# EAGLE design controller (EAGLE 7.1.0)
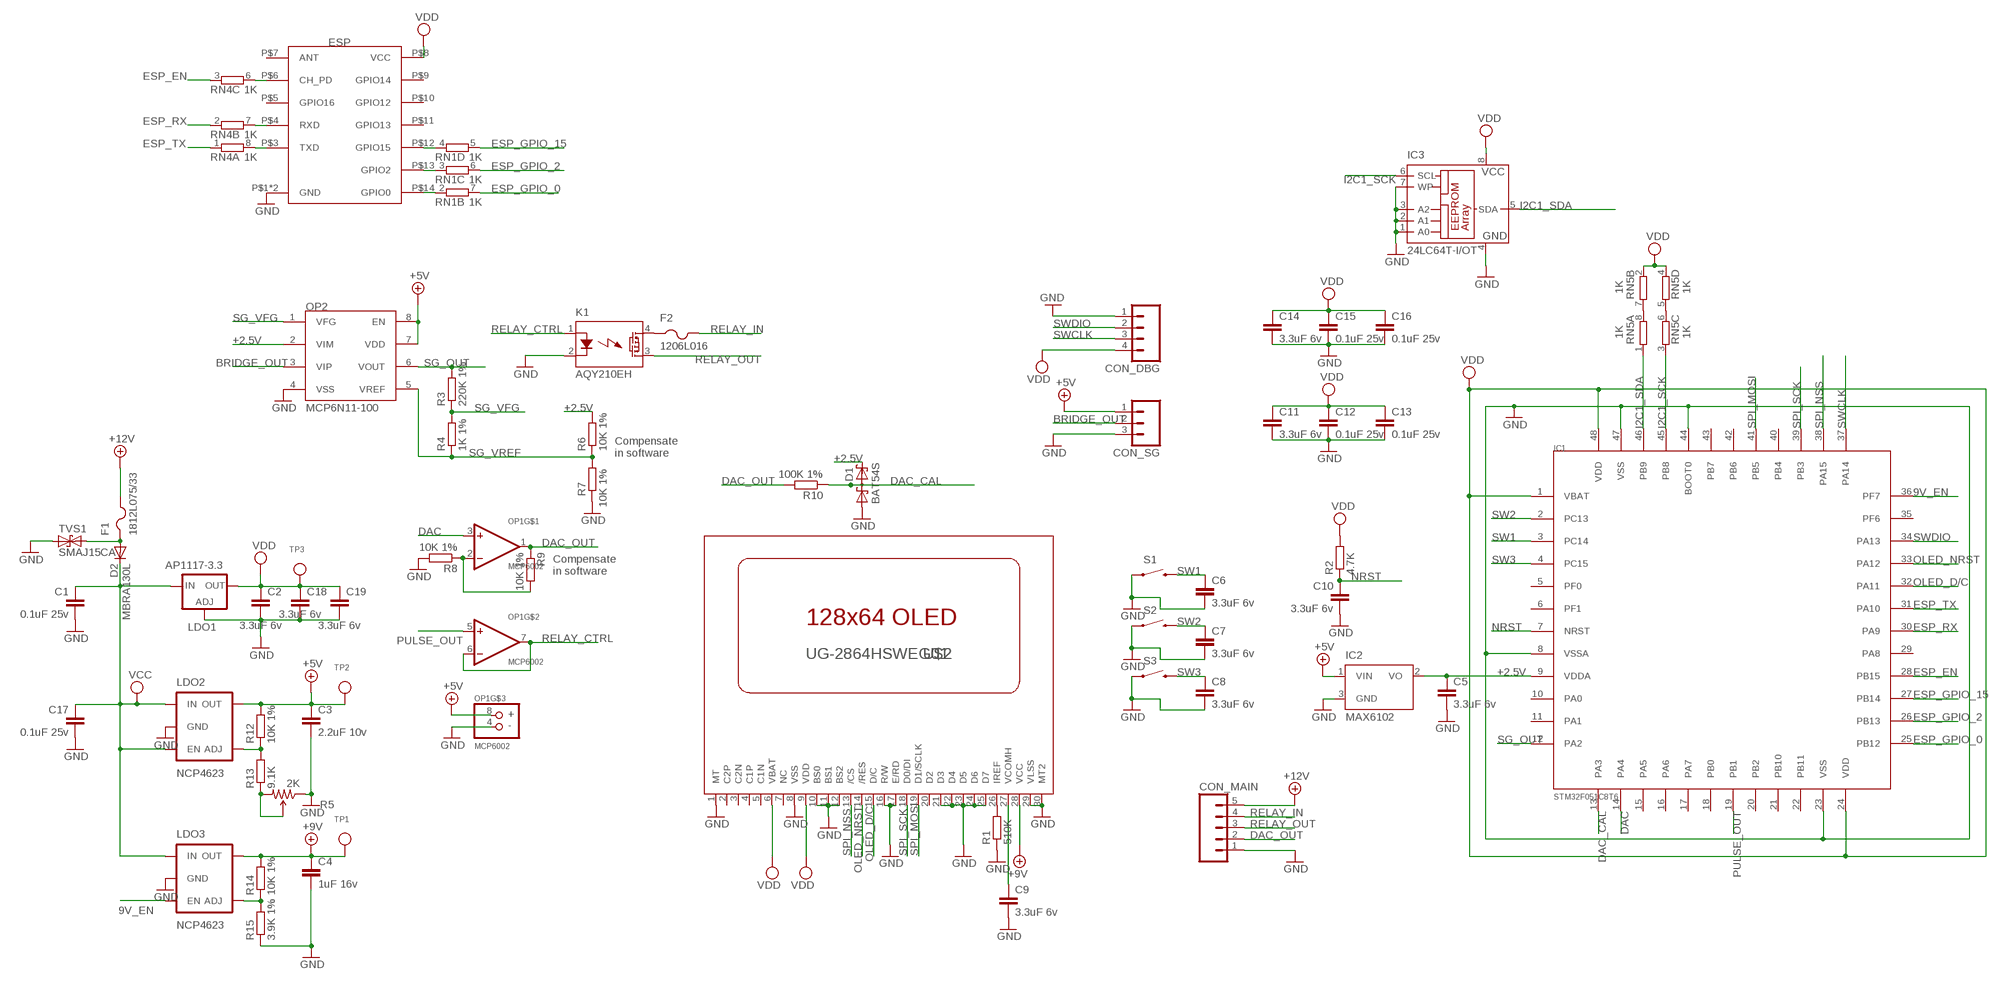
[diagram p0: schematic, sheet 1]

## Parts
C1  0.1uF 25v  C-EUC0603  [C0603]
C2  3.3uF 6v  C-EUC0603  [C0603]
C3  2.2uF 10v  C-EUC0603  [C0603]
C4  1uF 16v  C-EUC0603  [C0603]
C5  3.3uF 6v  C-EUC0603  [C0603]
C6  3.3uF 6v  C-EUC0603  [C0603]
C7  3.3uF 6v  C-EUC0603  [C0603]
C8  3.3uF 6v  C-EUC0603  [C0603]
C9  3.3uF 6v  C-EUC0603  [C0603]
C10  3.3uF 6v  C-EUC0603  [C0603]
C11  3.3uF 6v  C-EUC0603  [C0603]
C12  0.1uF 25v  C-EUC0603  [C0603]
C13  0.1uF 25v  C-EUC0603  [C0603]
C14  3.3uF 6v  C-EUC0603  [C0603]
C15  0.1uF 25v  C-EUC0603  [C0603]
C16  0.1uF 25v  C-EUC0603  [C0603]
C17  0.1uF 25v  C-EUC0603  [C0603]
C18  3.3uF 6v  C-EUC0603  [C0603]
C19  3.3uF 6v  C-EUC0603  [C0603]
CON_DBG  M04LOCK  [1X04_LOCK]
CON_MAIN  M05LOCK  [1X05_LOCK]
CON_SG  M03LOCK  [1X03_LOCK]
D1  BAT54S  [SOT23]
D2  MBRA130L  DIODESMA  [SMA-DIODE]
ESP  ESP8266  [ESP-03]
F1  1812L075/33  PTCFUSE-1812  [1812]
F2  1206L016  PTCFUSE-1206  [R1206]
IC1  STM32F051C8T6  STM32F05XC  [LQFP-48]
IC2  MAX6102  MC1525TT  [SOT23]
IC3  24LC64T-I/OT  24C01ASN  [SO-08]
K1  AQY210EH  AQY21SOP  [SOP04]
LDO1  AP1117-3.3  LD117ADT33TR  [DPACK]
LDO2  NCP4623  [SOT23-5]
LDO3  NCP4623  [SOT23-5]
OP1  MCP6002  MCP6022-MSOP  [MSOP-8]
OP2  MCP6N11-100  MCP6N11  [SO08]
R1  510K  R-EU_R0603  [R0603]
R2  4.7K  R-EU_R0603  [R0603]
R3  220K 1%  R-EU_R0603  [R0603]
R4  1K 1%  R-EU_R0603  [R0603]
R5  2K  TRIMPOT3MM-2  [TRIMPOT-3MM-2]
R6  10K 1%  R-EU_R0603  [R0603]
R7  10K 1%  R-EU_R0603  [R0603]
R8  10K 1%  R-EU_R0603  [R0603]
R9  10K 1%  R-EU_R0603  [R0603]
R10  100K 1%  R-EU_R0603  [R0603]
R12  10K 1%  R-EU_R0603  [R0603]
R13  9.1K  R-EU_R0603  [R0603]
R14  10K 1%  R-EU_R0603  [R0603]
R15  3.9K 1%  R-EU_R0603  [R0603]
RN1  1K  4R-NCAY16  [CAY16]
RN4  1K  4R-NCAY16  [CAY16]
RN5  1K  4R-NCAY16  [CAY16]
S1  SWITCH-MOMENTARY-2SMD-2  [TACTILE_SWITCH_SMD-2]
S2  SWITCH-MOMENTARY-2SMD-2  [TACTILE_SWITCH_SMD-2]
S3  SWITCH-MOMENTARY-2SMD-2  [TACTILE_SWITCH_SMD-2]
TP1  TESTPOINTROUND2MM  [TESTPOINT_ROUND_2MM]
TP2  TESTPOINTROUND2MM  [TESTPOINT_ROUND_2MM]
TP3  TESTPOINTROUND2MM  [TESTPOINT_ROUND_2MM]
TVS1  SMAJ15CA  TVS  [SMA-DIODE]
U$2  UG-2864HSWEG01  [1X30-0.7MM]

## Nets
9V_EN: IC1.36(PF7) LDO3.5(EN)
+2.5V: C5.1 D1.2(C2) IC1.9(VDDA) IC2.2(VO) OP2.2(VIM) R6.2
+5V: C3.1 CON_SG.1 IC2.1(VIN) LDO2.1(OUT) OP1.8(+) OP2.7(VDD) OP2.8(EN) R12.2 TP2.P$1
+9V: C4.1 LDO3.1(OUT) R14.2 TP1.P$1 U$2.28(VCC)
+12V: CON_MAIN.5 F1.2
BRIDGE_OUT: CON_SG.2 OP2.3(VIP)
DAC: IC1.14(PA4) OP1.3(+IN)
DAC_CAL: D1.3(C1A2) IC1.13(PA3) R10.1
DAC_OUT: CON_MAIN.2 OP1.1(OUT) R9.1 R10.2
ESP_EN: IC1.28(PB15) RN4.3
ESP_GPIO_0: IC1.25(PB12) RN1.7
ESP_GPIO_2: IC1.26(PB13) RN1.6
ESP_GPIO_15: IC1.27(PB14) RN1.5
ESP_RX: IC1.30(PA9) RN4.2
ESP_TX: IC1.31(PA10) RN4.1
GND: C1.2 C2.2 C3.2 C4.2 C5.2 C6.2 C7.2 C8.2 C9.2 C10.2 C11.2 C12.2 C13.2 C14.2 C15.2 C16.2 C17.2 C18.2 C19.2 CON_DBG.1 CON_MAIN.1 CON_SG.3 D1.1(A1) ESP.P$1(GND) ESP.P$2(GND) IC1.8(VSSA) IC1.23(VSS) IC1.44(BOOT0) IC1.47(VSS) IC2.3(GND) IC3.1(A0) IC3.2(A1) IC3.3(A2) IC3.4(GND) IC3.7(WP) K1.2(K) LDO1.1(ADJ) LDO2.2(GND) LDO3.2(GND) OP1.4(-) OP2.4(VSS) R1.1 R5.1(CCW) R7.1 R8.2 R15.1 S1.2 S2.2 S3.2 TVS1.A U$2.1(MT) U$2.8(VSS) U$2.10(BS0) U$2.11(BS1) U$2.12(BS2) U$2.16(R/W) U$2.17(E/RD) U$2.21(D3) U$2.22(D4) U$2.23(D5) U$2.24(D6) U$2.25(D7) U$2.29(VLSS) U$2.30(MT2)
I2C1_SCK: IC1.45(PB8) IC3.6(SCL) RN5.3
I2C1_SDA: IC1.46(PB9) IC3.5(SDA) RN5.1
N$1: OP1.2(-IN) R8.1 R9.2
N$2: C9.1 U$2.27(VCOMH)
N$3: R1.2 U$2.26(IREF)
N$4: D2.A F1.1 TVS1.C
N$5 [High Voltage]: F2.1 K1.4(DS1)
N$6: LDO2.4(ADJ) R12.1 R13.2
N$7: LDO3.4(ADJ) R14.1 R15.2
N$8: R5.2(WIPER) R5.3(CW) R13.1
N$10: ESP.P$14(GPIO0) RN1.2
N$11: ESP.P$13(GPIO2) RN1.3
N$12: ESP.P$12(GPIO15) RN1.4
N$14: ESP.P$3(TXD) RN4.8
N$15: ESP.P$6(CH_PD) RN4.6
N$16: ESP.P$4(RXD) RN4.7
N$17: RN5.7 RN5.8
N$18: RN5.5 RN5.6
NRST: C10.1 IC1.7(NRST) R2.1
OLED_D/C: IC1.32(PA11) U$2.15(D/C)
OLED_NRST: IC1.33(PA12) U$2.14(/RES)
PULSE_OUT: IC1.19(PB1) OP1.5(+IN)
RELAY_CTRL: K1.1(A) OP1.6(-IN) OP1.7(OUT)
RELAY_IN [High Voltage]: CON_MAIN.4 F2.2
RELAY_OUT [High Voltage]: CON_MAIN.3 K1.3(DS2)
SG_OUT: IC1.12(PA2) OP2.6(VOUT) R3.2
SG_VFG: OP2.1(VFG) R3.1 R4.2
SG_VREF: OP2.5(VREF) R4.1 R6.1 R7.2
SPI_MOSI: IC1.41(PB5) U$2.19(D1/SCLK)
SPI_NSS: IC1.38(PA15) U$2.13(/CS)
SPI_SCK: IC1.39(PB3) U$2.18(D0/DI)
SW1: C6.1 IC1.3(PC14) S1.1
SW2: C7.1 IC1.2(PC13) S2.1
SW3: C8.1 IC1.4(PC15) S3.1
SWCLK: CON_DBG.3 IC1.37(PA14)
SWDIO: CON_DBG.2 IC1.34(PA13)
VCC: C1.1 C17.1 D2.C LDO1.3(IN) LDO2.3(IN) LDO2.5(EN) LDO3.3(IN)
VDD: C2.1 C11.1 C12.1 C13.1 C14.1 C15.1 C16.1 C18.1 C19.1 CON_DBG.4 ESP.P$8(VCC) IC1.1(VBAT) IC1.24(VDD) IC1.48(VDD) IC3.8(VCC) LDO1.4(OUT) R2.2 RN5.2 RN5.4 TP3.P$1 U$2.6(VBAT) U$2.9(VDD)
Unconnected: ESP.P$5(GPIO16) ESP.P$7(ANT) ESP.P$9(GPIO14) ESP.P$10(GPIO12) ESP.P$11(GPIO13) IC1.5(PF0) IC1.6(PF1) IC1.10(PA0) IC1.11(PA1) IC1.15(PA5) IC1.16(PA6) IC1.17(PA7) IC1.18(PB0) IC1.20(PB2) IC1.21(PB10) IC1.22(PB11) IC1.29(PA8) IC1.35(PF6) IC1.40(PB4) IC1.42(PB6) IC1.43(PB7) RN1.1 RN1.8 RN4.4 RN4.5 U$2.2(C2P) U$2.3(C2N) U$2.4(C1P) U$2.5(C1N) U$2.7(NC) U$2.20(D2)

## Notes on the sheet
- Compensate 
  in software
- Compensate 
  in software

## Library data of the parts
C1-C19 = resistor:C-EU: CAPACITOR, European symbol
CON_DBG = SparkFun-Connectors:M04: Header 4 Standard 4-pin 0.1" header. Use with straight break away headers (SKU : PRT-00116), right angle break away headers (PRT-00553), swiss pins (PRT-00743), machine pins (PRT-00117), and female headers (PRT-00115). Molex polarized connector foot print use with SKU : PRT-08231 with associated crimp pins and housings. 1MM SMD Version SKU: PRT-10208
CON_MAIN = SparkFun-Connectors:M05: Header 5 Standard 5-pin 0.1" header. Use with straight break away headers (SKU : PRT-00116), right angle break away headers (PRT-00553), swiss pins (PRT-00743), machine pins (PRT-00117), and female headers (PRT-00115). Molex polarized connector foot print use with SKU : PRT-08230 with associated crimp pins and housings.
CON_SG = SparkFun-Connectors:M03: Header 3 Standard 3-pin 0.1" header. Use with straight break away headers (SKU : PRT-00116), right angle break away headers (PRT-00553), swiss pins (PRT-00743), machine pins (PRT-00117), and female headers (PRT-00115). Molex polarized connector foot print use with SKU : PRT-08232 with associated crimp pins and housings.
D1 = diode:BAT54S: Schottky Diodes Pin connection corrected 2011-05-04 Source: Fairchild .. BAT54.pdf
D2 = SparkFun-DiscreteSemi:DIODE: Diode These are standard reverse protection diodes and small signal diodes. SMA package can handle up to about 1A. SOD-323 can handle about 200mA. What the SOD-323 package when ordering, there are some mfgs out there that are 5-pin packages.
ESP = misc:ESP8266
F1 F2 = adafruit:PTCFUSE: PTC fuses, resettable thermistors
IC1 = misc:STM32F05XC
IC2 = microchip:MC15*: 2.5V and 4.096V Voltage References Source: http://www.microchip.com .. 21653b.pdf; OC_FARNELL: unknown; OC_NEWARK: unknown
IC3 = microchip:24C*: Serial EEPROM 1 K/2 K/4 K; MPN: AT24C01BN-SH-B; OC_FARNELL: 1362638; OC_NEWARK: 50M3313
K1 = relay:AQY*: PhotoMOS Relay NAiS Source: http://www.panasonic-electric-works.com/catalogues/downloads/photomos/ds_x615_en_aqz10_20.pdf; OC_FARNELL: unknown; OC_NEWARK: unknown
LDO1 = v-reg:LD117A?*: Low drop fixed and adjustable positive voltage regulators 1 A Source: http://www.st.com/stonline/products/literature/ds/7194/ld1117axx.pdf
LDO2 LDO3 = misc:NCP4623
OP1 = misc:MCP6022: MCP6022 - Dual Rail-to-Rail 10MHz Op-Amp Digikey: SOIC8 - MCP6022-I/SN-ND
OP2 = misc:MCP6N11
R1-R4 R6-R10 R12-R15 = resistor:R-EU_: RESISTOR, European symbol
R5 = SparkFun-Electromechanical:TRIMPOT: Various small potentiometers for "set-and-forget" applications
RN1 RN4 RN5 = resistor-dil:4R-N: Array Chip Resistor Source: RS Component / Phycomp; OC_FARNELL: unknown; OC_NEWARK: unknown
S1-S3 = misc:SWITCH-MOMENTARY-2
TP1-TP3 = microbuilder:TESTPOINT: Test Point Various test points for characterisation and PCB testing TESTPOINT_SMT - Compact Surface Mount Test Point [Digikey: 5016KTR-ND]
TVS1 = SparkFun-DiscreteSemi:TVS: Transient voltage suppressor- prevents ESD on inputs. Ignore package description- MBRA140 is NOT this type of part!!!
U$2 = SparkFun:UG-2864HSWEG01: UG-2864HSWEG01 OLED display

## Net classes
1 High Voltage: clearance 0.406 mm to class 0, clearance 0.406 mm

## Board
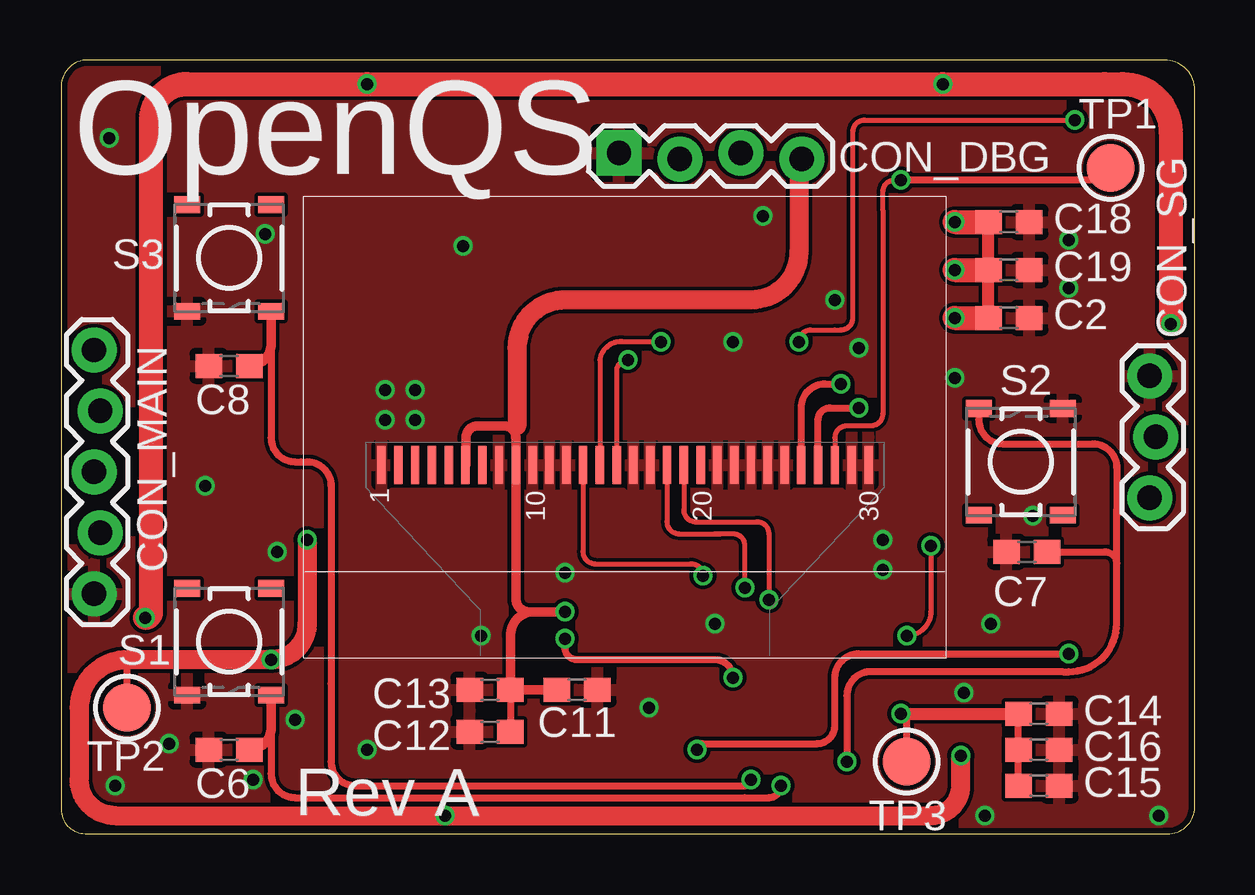
[diagram p1: board, top side]
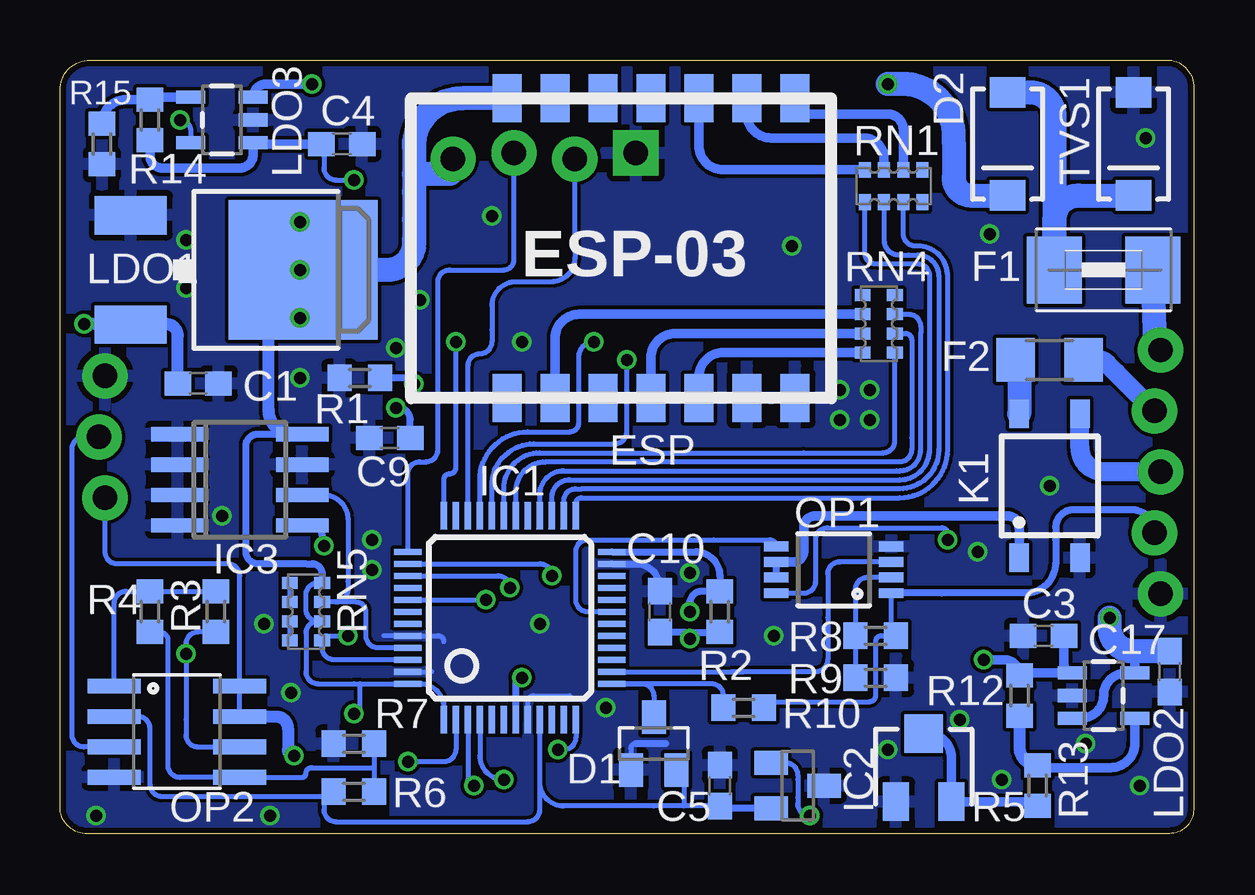
[diagram p2: board, bottom side, seen from below]

Size 47.26 x 32.26 mm. Coordinates in mm from the lower left corner, seen from the top.
Outline: 46.01,32.26 1.01,32.26 arc90 0.01,31.01 0.01,1.01 arc90 1.01,0.01 46.01,0.01 arc90 47.26,1.01 47.26,31.01 arc90 46.01,32.26
Copper layers (1*16): Top 0.035mm / dielectric 1.5mm / Bottom 0.035mm
Design rules "SeeedStudio_2layer_DRU_no_angle_20140221": minimum track width 6mil, minimum drill 12mil, track to track 6mil, track to pad 6mil, pad to pad 6mil, via to via 6mil, smd to smd 0mil, copper to edge 10mil, drill to drill 10mil, minimum pad ring 10mil, minimum via ring 6mil, stop-mask expansion 2mil, vias tented up to drill 100mil, thermal gap 10mil

### Footprints (pad centres in the part's own frame; a part is rotated, then mirrored left to right if it is on the bottom)
C0603 = smd 1.1 x 1: 1 -0.85,0; 2 0.85,0
1X04_LOCK = drill 1.016 pad 1.88 square: 1 0,0.127 | drill 1.016 pad 1.88: 2 2.54,-0.127; 3 5.08,0.127; 4 7.62,-0.127
1X05_LOCK = drill 1.016 pad 1.88: 1 0,0.127; 2 2.54,-0.127; 3 5.08,0.127; 4 7.62,-0.127; 5 10.16,0.127
1X03_LOCK = drill 1.016 pad 1.88: 1 0,0.127; 2 2.54,-0.127; 3 5.08,0.127
SOT23 = smd 1 x 1.4: 1 -0.95,-1.1; 2 0.95,-1.1; 3 0,1.1
SMA-DIODE = smd 1.27 x 1.47: A -2.15,0; C 2.15,0
ESP-03 = smd 2 x 1.2: P$1 -6.35,-7.39; P$2 -6.35,-5.39; P$3 -6.35,-3.39; P$4 -6.35,-1.39; P$5 -6.35,0.61; P$6 -6.35,2.61; P$7 -6.35,4.61; P$8 6.15,4.61; P$9 6.15,2.61; P$10 6.15,0.61; P$11 6.15,-1.39; P$12 6.15,-3.39; P$13 6.15,-5.39; P$14 6.15,-7.39
1812 = smd 2.286 x 2.794: 1 -2.046,0; 2 2.046,0
R1206 = smd 1.6 x 1.803: 1 -1.422,0; 2 1.422,0
LQFP-48 = smd 0.254 x 1.143: 1 -2.75,-4.25; 2 -2.25,-4.25; 3 -1.75,-4.25; 4 -1.25,-4.25; 5 -0.75,-4.25; 6 -0.25,-4.25; 7 0.25,-4.25; 8 0.75,-4.25; 9 1.25,-4.25; 10 1.75,-4.25; 11 2.25,-4.25; 12 2.75,-4.25; 25 2.75,4.25; 26 2.25,4.25; 27 1.75,4.25; 28 1.25,4.25; 29 0.75,4.25; 30 0.25,4.25; 31 -0.25,4.25; 32 -0.75,4.25; 33 -1.25,4.25; 34 -1.75,4.25; 35 -2.25,4.25; 36 -2.75,4.25 | smd 1.143 x 0.254: 13 4.25,-2.75; 14 4.25,-2.25; 15 4.25,-1.75; 16 4.25,-1.25; 17 4.25,-0.75; 18 4.25,-0.25; 19 4.25,0.25; 20 4.25,0.75; 21 4.25,1.25; 22 4.25,1.75; 23 4.25,2.25; 24 4.25,2.75; 37 -4.25,2.75; 38 -4.25,2.25; 39 -4.25,1.75; 40 -4.25,1.25; 41 -4.25,0.75; 42 -4.25,0.25; 43 -4.25,-0.25; 44 -4.25,-0.75; 45 -4.25,-1.25; 46 -4.25,-1.75; 47 -4.25,-2.25; 48 -4.25,-2.75
SO-08 = smd 0.6 x 2.2: 1 -1.905,-2.6; 2 -0.635,-2.6; 3 0.635,-2.6; 4 1.905,-2.6; 5 1.905,2.6; 6 0.635,2.6; 7 -0.635,2.6; 8 -1.905,2.6
SOP04 = smd 0.8 x 1.2: 1 -1.27,-3; 2 1.27,-3; 3 1.27,3; 4 -1.27,3
DPACK = smd 1.6 x 3: 1 -2.28,-4.8; 3 2.28,-4.8 | smd 5.8 x 6.2: 4 0,2.38
SOT23-5 = smd 0.55 x 1.2: 1 -0.95,-1.3; 2 0,-1.3; 3 0.95,-1.3; 4 0.95,1.3; 5 -0.95,1.3
MSOP-8 = smd 0.41 x 1.02: 1 -0.975,-2.4; 2 -0.325,-2.4; 3 0.325,-2.4; 4 0.975,-2.4; 5 0.975,2.4; 6 0.325,2.4; 7 -0.325,2.4; 8 -0.975,2.4
SO08 = smd 0.61 x 2.21: 1 -1.905,-2.616; 2 -0.635,-2.616; 3 0.635,-2.616; 4 1.905,-2.616; 5 1.905,2.616; 6 0.635,2.616; 7 -0.635,2.616; 8 -1.905,2.616
R0603 = smd 1 x 1.1: 1 -0.85,0; 2 0.85,0
TRIMPOT-3MM-2 = smd 1.092 x 1.6: 1 -1.155,-1.421; 3 1.155,-1.421 | smd 1.6 x 1.6: 2 0,1.421
CAY16 = smd 0.5 x 0.65: 1 -1.2,-0.675; 2 -0.4,-0.675; 3 0.4,-0.675; 4 1.2,-0.675; 5 1.2,0.675; 6 0.4,0.675; 7 -0.4,0.675; 8 -1.2,0.675
TACTILE_SWITCH_SMD-2 = smd 0.7 x 1.1: 1 2.225,1.75; 2 2.225,-1.75; 3 -2.225,-1.75; 4 -2.225,1.75
TESTPOINT_ROUND_2MM = smd 2 x 2: P$1 0,0
1X30-0.7MM = smd 0.35 x 1.6: 1 -10.15,-0.635; 2 -9.45,-0.635; 3 -8.75,-0.635; 4 -8.05,-0.635; 5 -7.35,-0.635; 6 -6.65,-0.635; 7 -5.95,-0.635; 8 -5.25,-0.635; 9 -4.55,-0.635; 10 -3.85,-0.635; 11 -3.15,-0.635; 12 -2.45,-0.635; 13 -1.75,-0.635; 14 -1.05,-0.635; 15 -0.35,-0.635; 16 0.35,-0.635; 17 1.05,-0.635; 18 1.75,-0.635; 19 2.45,-0.635; 20 3.15,-0.635; 21 3.85,-0.635; 22 4.55,-0.635; 23 5.25,-0.635; 24 5.95,-0.635; 25 6.65,-0.635; 26 7.35,-0.635; 27 8.05,-0.635; 28 8.75,-0.635; 29 9.45,-0.635; 30 10.15,-0.635

### Placement (x,y rotation side)
C1  41.5,18.78 0 bottom
C2  39.51,21.51 0 top
C3  6.26,8.26 180 bottom
C4  35.51,28.76 0 bottom
C5  19.76,2.01 90 bottom
C6  7.01,3.51 180 top
C7  40.26,11.76 180 top
C8  7.01,19.51 180 top
C9  33.51,16.51 180 bottom
C10  22.26,9.26 90 bottom
C11  21.51,6.01 0 top
C12  17.88,4.26 180 top
C13  17.88,6.01 180 top
C14  40.76,5.01 0 top
C15  40.76,2.01 0 top
C16  40.76,3.51 0 top
C17  1.01,6.76 270 bottom
C18  39.51,25.51 0 top
C19  39.51,23.51 0 top
CON_DBG  23.26,28.26 0 top
CON_MAIN  1.51,10.01 90 top
CON_SG  45.51,14.01 90 top
D1  22.51,3.76 0 bottom
D2  7.76,28.76 270 bottom
ESP  24.01,24.51 90 bottom
F1  3.76,23.51 0 bottom
F2  6.01,19.76 0 bottom
IC1  28.51,9.01 0 bottom
IC2  16.51,2.01 270 bottom
IC3  39.76,14.76 270 bottom
K1  6.01,14.51 0 bottom
LDO1  39.51,23.51 270 bottom
LDO2  3.76,5.76 270 bottom
LDO3  40.51,29.76 90 bottom
OP1  15.01,11.01 90 bottom
OP2  42.38,4.26 270 bottom
R1  34.76,19.01 0 bottom
R2  19.76,9.26 90 bottom
R3  40.76,9.26 270 bottom
R4  43.51,9.26 90 bottom
R5  11.26,2.76 0 bottom
R6  35.01,1.76 180 bottom
R7  35.01,3.76 0 bottom
R8  13.26,6.51 0 bottom
R9  13.26,8.26 180 bottom
R10  18.76,5.26 0 bottom
R12  7.26,5.76 90 bottom
R13  6.51,2.01 90 bottom
R14  43.51,29.76 270 bottom
R15  45.51,28.76 90 bottom
RN1  12.51,27.01 180 bottom
RN4  13.13,21.26 90 bottom
RN5  37.01,9.26 90 bottom
S1  7.01,8.01 270 top
S2  40.01,15.51 90 top
S3  7.01,24.01 270 top
TP1  43.76,27.76 0 top
TP2  2.76,5.26 0 top
TP3  35.26,3.01 0 top
TVS1  2.51,28.76 270 bottom
U$2  23.51,16.01 0 top

### Tracks (layer width: path | path; a pad name or v marks a point on that pad's centre or on a via)
9V_EN  (via drill 0.5)
  Top 0.2: v30.76,20.51 arc-90 31.26,21.01 32.26,21.01 32.51,21.01 arc90 33.01,21.51 33.01,29.01 33.01,29.26 arc-90 33.51,29.76 v42.26,29.76
  Bottom 0.2: IC1.36 31.26,14.76 arc90 31.01,15.01 arc-90 30.76,15.26 v30.76,20.51 | v42.26,29.76 arc90 41.81,29.31 LDO3.5
+2.5V
  Bottom 0.2: C5.1 21.26,1.16 | 21.26,1.16 22.51,1.16 26.26,1.16 arc90 27.26,2.16 | 27.26,2.16 IC1.9 | 27.26,2.16 27.26,1.01 arc90 27.76,0.51 35.76,0.51 arc90 36.26,1.01 36.26,1.48 36.13,1.48 arc-90 R6.2 arc90 36.06,1.56 43.01,1.56 arc90 43.51,2.06 43.51,4.39 arc-90 44.01,4.89 OP2.2 | D1.2 arc90 21.26,2.61 21.26,1.16
  Bottom 0.3: IC2.2 19.66,1.06 arc90 C5.1
+5V  (via drill 0.5)
  Top 0.3: TP2.P$1 2.76,7.26
  Top 0.8: 37.51,2.01 37.51,2.26 | 37.51,2.26 v37.51,3.26 | 37.51,2.01 arc-90 36.26,0.76 v16.01,0.76 2.26,0.76 arc-90 0.76,2.26 0.76,5.26 arc-90 2.76,7.26 v8.76,7.26 arc90 10.26,8.76 v10.26,12.26 | 37.51,2.01 37.51,2.26
  Bottom 0.2: CON_SG.1 45.38,11.76 arc-90 44.88,11.26 40.51,11.26 40.27,11.26 arc90 39.77,10.76 OP2.8 OP2.7 | IC2.1 17.01,2.96 arc90 16.51,2.46 16.51,2.26 16.51,1.51 16.51,1.26 arc-90 v16.01,0.76 | OP1.8 16.26,10.03 arc-90 15.76,10.53 15.76,12.26 arc90 15.26,12.76 10.51,12.76 arc90 10.26,12.51 v10.26,12.26
  Bottom 0.4: C3.1 5.41,7.06 arc-90 LDO2.1 7.16,6.71 arc-90 R12.2 arc-90 7.91,7.26 v8.76,7.26
  Bottom 0.5: OP2.7 38.26,4.89 arc90 37.76,4.39 37.76,3.51 arc-90 v37.51,3.26
+9V  (via drill 0.5)
  Top 0.2: U$2.28 32.26,16.51 arc-90 32.76,17.01 33.01,17.01 33.76,17.01 arc90 34.26,17.51 34.26,26.01 34.26,26.76 arc-90 34.76,27.26 v35.01,27.26
  Top 0.3: TP1.P$1 arc-90 43.26,27.26 v35.01,27.26
  Bottom 0.2: C4.1 arc90 36.26,28.66 36.26,27.76 arc-90 35.76,27.26 v35.01,27.26
  Bottom 0.4: C4.1 39.16,28.76 arc90 LDO3.1 39.21,28.31 arc90 39.76,27.76 43.01,27.76 arc90 43.51,28.26 R14.2
+12V
  Bottom 1: CON_MAIN.5 arc90 1.61,20.39 F1.2
BRIDGE_OUT
  Bottom 0.2: OP2.3 46.26,3.62 arc90 46.76,4.12 46.76,15.51 46.76,16.05 arc90 46.26,16.55 CON_SG.2
DAC
  Bottom 0.2: IC1.14 19.26,6.76 | 19.26,6.76 19.01,6.76 18.76,6.76 | OP1.3 14.76,11.33 arc-90 15.26,10.83 15.26,9.01 15.26,7.26 arc90 15.76,6.76 19.26,6.76
DAC_CAL
  Bottom 0.2: 24.11,6.26 IC1.13 24.11,6.26 | R10.1 19.61,5.76 arc-90 20.11,6.26 24.11,6.26 | 24.11,6.26 23.01,6.26 arc90 22.51,5.76 D1.3
DAC_OUT
  Bottom 0.2: OP1.1 12.61,8.46 arc-90 R9.1 13.01,8.26 arc-90 13.26,8.01 13.26,5.76 arc90 13.51,5.51 17.66,5.51 arc-90 R10.2
  Bottom 0.3: CON_MAIN.2 arc-90 2.59,13.51 4.76,13.51 5.01,13.51 arc-90 5.76,12.76 5.76,12.26 5.76,11.28 arc90 7.01,10.03 10.51,10.03 OP1.1
ESP_EN
  Bottom 0.2: IC1.28 27.26,14.13 arc90 26.26,15.13 12.38,15.13 12.26,15.13 arc-90 11.38,16.01 11.38,20.88 11.38,21.16 arc-90 11.88,21.66 RN4.3
ESP_GPIO_0
  Bottom 0.2: IC1.25 25.76,13.76 arc90 25.51,14.01 12.26,14.01 arc-90 10.26,16.01 10.26,23.26 arc-90 11.51,24.51 11.61,24.51 arc90 12.11,25.01 RN1.7
ESP_GPIO_2
  Bottom 0.2: RN1.6 12.91,24.76 arc-90 12.28,24.13 11.88,24.13 11.51,24.13 arc90 10.63,23.26 10.63,16.01 arc90 12.26,14.38 25.51,14.38 25.76,14.38 arc-90 26.26,13.88 IC1.26
ESP_GPIO_15
  Bottom 0.2: IC1.27 26.76,14.01 arc90 26.01,14.76 12.26,14.76 arc-90 11.01,16.01 11.01,23.26 arc-90 11.51,23.76 13.26,23.76 arc90 13.71,24.21 RN1.5
ESP_RX
  Bottom 0.2: RN4.2 12.01,20.86 arc90 11.76,20.61 11.76,16.51 11.76,16.01 arc90 12.26,15.51 27.01,15.51 arc-90 28.26,14.26 IC1.30
ESP_TX
  Bottom 0.2: IC1.31 28.76,14.38 arc90 27.26,15.88 16.26,15.88 12.96,15.88 arc-90 12.46,16.38 RN4.1
GND  (via drill 0.5)
  Bottom 0.2: 27.76,5.51 IC1.8 27.76,5.51 | 27.76,5.51 arc90 27.51,5.76 | IC1.47 31.76,6.76 | 33.76,8.26 IC1.44 31.51,8.26 arc90 31.26,8.01 | 27.76,5.51 arc90 27.51,5.76 | 27.51,5.76 26.01,5.76 | 23.26,3.76 arc-90 23.46,3.56 D1.1
  Bottom 0.3: IC1.23 23.26,11.26 arc90 22.26,10.26 C10.2 | 22.01,3.76 23.26,3.76
  other vias: 4.51,3.76 6.01,14.51 2.26,2.01 9.01,11.76 45.76,0.76 38.51,0.76 38.76,8.76 34.26,12.26 21.01,10.88 12.76,3.51 37.63,5.88 17.51,8.26 24.51,5.26 28.01,20.51 16.76,24.51 29.26,25.76 13.51,18.51 14.76,18.51 13.51,17.26 14.76,17.26 2.01,29.01 9.76,4.76 34.26,11.01 40.51,13.26 8.51,25.01 27.26,8.76 37.26,19.01 32.26,22.26 42.01,24.76 42.01,22.76 33.26,20.26 8.01,2.26
  pour Bottom: 0.01,0.01 0.01,31.51 arc-90 0.51,32.01 47.01,32.01 47.01,0.01
  pour Top: 0.01,32.01 47.01,32.01 47.01,0.01 0.01,0.01
I2C1_SCK
  Bottom 0.2: IC1.45 34.01,7.76 arc90 34.51,8.26 34.51,9.26 arc-90 34.91,9.66 35.76,9.66 | 35.76,9.66 RN5.3 | IC3.6 36.26,14.12 arc90 35.26,13.12 35.26,10.51 35.26,10.16 arc90 35.76,9.66
I2C1_SDA  (via drill 0.5)
  Top 0.2: v36.26,12.01 36.26,9.26 arc-90 v35.26,8.26
  Bottom 0.2: IC1.46 35.83,7.26 arc90 36.33,7.76 RN5.1 arc90 36.13,8.26 v35.26,8.26
  Bottom 0.3: IC3.5 36.81,12.85 arc90 36.31,12.35 36.31,12.01 v36.26,12.01
N$1
  Bottom 0.2: OP1.2 13.61,10.68 arc-90 14.11,10.18 R9.2 R8.1
N$2  (via drill 0.5)
  Top 0.3: U$2.27 31.56,17.26 arc-90 32.06,17.76 v33.26,17.76
  Bottom 0.3: C9.1 32.66,17.26 arc-90 33.16,17.76 v33.26,17.76
N$3  (via drill 0.5)
  Top 0.3: U$2.26 30.86,17.76 arc-90 31.86,18.76 v32.51,18.76
  Bottom 0.3: v32.51,18.76 arc-90 32.76,19.01 R1.2
N$4
  Bottom 1: F1.1 5.8,25.01 | 5.8,25.01 5.8,25.61 arc90 4.8,26.61 TVS1.C | D2.A 6.8,30.91 arc90 5.8,29.91 5.8,25.01
N$5
  Bottom 1: F2.1 arc90 7.28,19.6 K1.4
N$6
  Bottom 0.4: R12.1 arc-90 7.41,4.76 | LDO2.4 2.46,3.76 arc90 3.46,2.76 6.41,2.76 arc90 R13.2
  Bottom 0.5: R13.2 arc90 7.26,3.61 R12.1
N$7
  Bottom 0.4: LDO3.4 43.41,30.71 arc-90 R14.1 44.51,30.61 arc-90 R15.2
N$8
  Bottom 0.4: R5.2 11.1,4.18 arc90 10.1,3.18 R5.3 6.69,1.34 arc90 R13.1
N$10
  Bottom 0.4: RN1.2 12.11,29.36 arc-90 12.76,30.01 16.51,30.01 16.51,30.55 arc-90 ESP.P$14
N$11
  Bottom 0.4: RN1.3 12.91,28.16 arc-90 13.76,29.01 17.62,29.01 arc90 18.62,30.01 ESP.P$13
N$12
  Bottom 0.4: RN1.4 19.62,27.68 arc90 20.62,28.68 ESP.P$12
N$14
  Bottom 0.4: RN4.8 19.62,20.06 arc-90 20.62,19.06 ESP.P$3
N$15
  Bottom 0.4: RN4.6 25.62,21.66 arc-90 26.62,20.66 ESP.P$6
N$16
  Bottom 0.4: RN4.7 21.62,20.86 arc-90 22.62,19.86 ESP.P$4
N$17
  Bottom 0.2: RN5.7 RN5.8
N$18
  Bottom 0.2: RN5.5 RN5.6
NRST  (via drill 0.5)
  Top 0.3: v28.01,6.51 arc90 27.26,7.26 21.51,7.26 arc-90 21.01,7.76 v21.01,8.13
  Bottom 0.3: IC1.7 28.26,6.26 arc90 v28.01,6.51 | R2.1 arc90 19.78,8.38 20.76,8.38 arc-90 v21.01,8.13 arc-90 21.28,8.41 C10.1
OLED_D/C  (via drill 0.5)
  Top 0.2: v23.63,19.76 arc90 23.16,19.28 U$2.15
  Bottom 0.2: IC1.32 29.26,14.51 arc90 27.51,16.26 24.13,16.26 arc-90 23.63,16.76 v23.63,19.76
OLED_NRST  (via drill 0.5)
  Top 0.2: v25.01,20.51 23.46,20.51 arc90 22.46,19.76 U$2.14
  Bottom 0.2: IC1.33 29.76,14.76 arc90 27.76,16.76 26.01,16.76 arc-90 25.63,17.13 25.63,19.88 arc90 v25.01,20.51
PULSE_OUT
  Bottom 0.2: IC1.19 25.26,9.26 arc90 25.76,9.76 25.76,11.76 arc90 25.26,12.26 20.01,12.26 17.68,12.26 arc90 OP1.5
RELAY_CTRL
  Bottom 0.3: OP1.6 OP1.7
  Bottom 0.4: OP1.6 16.68,11.33 arc-90 16.26,11.76 16.26,12.76 arc90 15.76,13.26 14.51,13.26 7.78,13.26 arc90 7.28,12.76 K1.1
RELAY_IN
  Bottom 0.8: CON_MAIN.4 3.22,19.21 3.62,19.61 arc-45 3.97,19.76 F2.2
RELAY_OUT
  Bottom 0.8: CON_MAIN.3 3.74,15.09 arc90 4.74,16.09 K1.3
SG_OUT  (via drill 0.5)
  Top 0.3: v26.51,3.51 arc-90 26.76,3.76 31.51,3.76 arc90 32.26,4.51 32.26,5.51 32.26,6.51 arc-90 33.26,7.51 v42.01,7.51
  Bottom 0.2: R3.2 41.51,8.41 arc-90 42.01,7.91 v42.01,7.51 42.01,4.76 42.01,4.12 arc-90 41.51,3.62 OP2.6 | IC1.12 25.76,4.01 arc90 26.26,3.51 v26.51,3.51
SG_VFG
  Bottom 0.2: OP2.1 45,9.61 arc90 44.5,10.11 R4.2 R3.1
SG_VREF
  Bottom 0.2: R4.1 arc90 42.76,8.16 42.76,7.01 42.76,5.01 42.76,2.85 arc-90 42.26,2.35 OP2.5 37.16,2.35 arc-90 37.01,2.51 arc90 36.76,2.76 34.16,2.76 | R7.2 34.16,2.76 | 34.16,2.76 R6.1
SPI_MOSI  (via drill 0.5)
  Top 0.2: U$2.19 25.96,13.51 arc90 26.46,13.01 29.01,13.01 arc-90 29.51,12.51 v29.51,9.76
  Bottom 0.2: IC1.41 v29.51,9.76
SPI_NSS  (via drill 0.5)
  Top 0.2: U$2.13 21.76,11.76 arc90 22.26,11.26 26.26,11.26 arc-90 v26.76,10.76
  Bottom 0.2: IC1.38 27.26,11.26 arc90 v26.76,10.76
SPI_SCK  (via drill 0.5)
  Top 0.2: U$2.18 25.26,13.01 arc90 25.76,12.51 27.26,12.51 | 27.26,12.51 27.51,12.51 | v28.51,10.26 28.51,12.01 arc90 28.01,12.51 27.26,12.51
  Bottom 0.2: IC1.39 29.01,10.76 arc90 v28.51,10.26
SW1  (via drill 0.5)
  Top 0.3: 8.76,4.41 8.76,2.51 arc90 9.76,1.51 10.51,1.51 28.51,1.51 29.51,1.51 arc90 v30.01,2.01
  Top 0.4: C6.1 arc90 8.76,4.41 S1.1
  Bottom 0.2: IC1.3 30.26,2.26 arc-90 v30.01,2.01
SW2  (via drill 0.5)
  Top 0.3: S2.1 38.26,17.26 arc90 39.26,16.26 42.26,16.26 43.01,16.26 arc-90 44.01,15.26 44.01,13.51 | 44.01,13.51 44.01,13.26 | v32.76,3.01 32.76,5.76 arc-90 33.76,6.76 41.76,6.76 42.01,6.76 arc90 44.01,8.76 44.01,11.26 | 44.01,11.26 44.01,13.51 | C7.1 43.51,11.76 arc-90 44.01,11.26
  Bottom 0.2: IC1.2 30.76,3.51 arc90 31.26,3.01 v32.76,3.01
SW3  (via drill 0.5)
  Top 0.3: 8.76,20.41 8.76,16.51 arc90 9.76,15.51 10.01,15.51 10.26,15.51 arc-90 11.26,14.51 11.26,6.26 11.26,3.01 arc90 12.26,2.01 28.51,2.01 arc90 v28.76,2.26
  Top 0.4: C8.1 arc90 8.76,20.41 S3.1
  Bottom 0.2: IC1.4 29.76,3.26 arc-90 v28.76,2.26
SWCLK
  Bottom 0.2: IC1.37 32.76,15.01 arc90 32.26,15.51 32.01,15.51 arc-90 31.51,16.01 31.51,22.51 31.51,23.01 arc90 31.01,23.51 28.76,23.51 arc-90 28.34,23.93 CON_DBG.3
SWDIO
  Bottom 0.2: IC1.34 30.26,19.51 arc90 29.76,20.01 arc-90 29.26,20.51 29.26,21.01 29.26,22.01 arc90 28.26,23.01 26.8,23.01 arc-90 25.8,24.01 25.8,24.26 CON_DBG.2
VCC  (via drill 0.5)
  Top 1: v46.26,21.26 46.26,29.26 arc90 44.26,31.26 43.51,31.26 v36.76,31.26 v12.76,31.26 5.26,31.26 arc90 3.76,29.76 3.76,9.26 arc-90 v3.51,9.01
  Bottom 0.3: v46.26,21.26 arc-90 46.23,21.23 LDO1.3
  Bottom 0.4: LDO3.3 arc90 38.66,31.26 v36.76,31.26 | LDO2.3 4.71,4.81 arc-90 3.76,5.76 arc90 2.81,6.71 LDO2.5 2.46,7.56 arc-90 2.51,7.61
  Bottom 0.5: C1.1 42.35,20.76 arc-90 42.85,21.26 v46.26,21.26
  Bottom 1: v12.76,31.26 12.26,31.26 arc90 10.01,29.26 10.01,28.83 10.01,27.36 arc-90 9.26,26.61 D2.C | C17.1 2.51,7.61 arc90 3.51,8.61 v3.51,9.01
VDD  (via drill 0.5)
  Top 0.2: U$2.6 arc90 16.88,15.4 | U$2.9 arc-90 19.01,15.32 | 18.96,16.51 arc90 19.01,16.56 19.01,17.01 | 39.41,5.01 arc-90 39.91,4.51 C14.1
  Top 0.3: C13.1 C12.1 | 19.51,9.26 v21.01,9.26 | C15.1 C16.1 C14.1 | TP3.P$1 35.26,4.76 arc90 v35.01,5.01
  Top 0.4: C11.1 C13.1 18.73,8.26 arc-90 19.73,9.26 v21.01,9.26 | 16.88,15.4 16.88,16.51 arc-90 17.38,17.01 18.46,17.01 arc-90 18.96,16.51 U$2.9 18.96,9.81 arc90 19.51,9.26
  Top 0.5: v35.01,5.01 39.41,5.01 | C2.1 C19.1 C18.1
  Top 0.8: 19.01,17.01 19.01,20.26 arc-90 21.01,22.26 28.76,22.26 arc90 30.76,24.26 30.76,28.26 arc45 30.76,28.24 CON_DBG.4
  Top 1: v37.26,23.51 C19.1 | v37.26,21.51 C2.1 | v37.26,25.51 C18.1
  Bottom 0.2: 36.51,8.86 RN5.2 36.51,8.86 | 36.51,8.86 arc90 37.01,9.36 37.01,9.76 37.01,9.96 arc90 36.51,10.46 RN5.4 | 36.51,8.86 arc-90 37.01,8.36 37.01,6.76 arc-90 36.51,6.26 35.01,6.26 34.76,6.26 | 34.76,6.26 IC1.48 32.26,6.26 arc90 31.26,5.26 IC1.1 | v35.01,5.01 arc-90 34.76,5.26 34.76,6.26
  Bottom 0.3: IC1.24 20.76,11.76 arc90 19.76,10.76 R2.2 20.51,10.11 arc-90 21.01,9.61 v21.01,9.26 | RN5.4 36.33,10.83 arc-90 36.76,11.26 37.01,11.26 39.01,11.26 arc90 39.51,11.76 39.51,13.01 39.51,16.16 arc90 39.01,16.66 IC3.8
  Bottom 0.5: LDO1.4 38.06,23.51 arc-90 38.56,23.01 38.56,17.66 arc-90 37.56,16.66 IC3.8
  Bottom 1: LDO1.4 36.86,23.61 | 36.86,23.61 arc90 35.86,24.61 | ESP.P$8 30.51,30.66 arc-90 32.51,28.66 32.51,27.51 | 32.51,27.51 32.51,26.76 32.51,25.61 32.51,24.76 arc90 33.51,23.51 v37.26,23.51 | CON_DBG.4 arc90 31,27.51 32.51,27.51 | v37.26,23.51 38.91,23.76 | v37.26,23.51 arc-90 37.11,23.61 36.86,23.61

### Text on the board
tPlace: OpenQS | Rev A
tValues: Enclosure: RX2KL05/S-5